# EAGLE design Placa Principal - março 2018 (EAGLE 9.0.1)
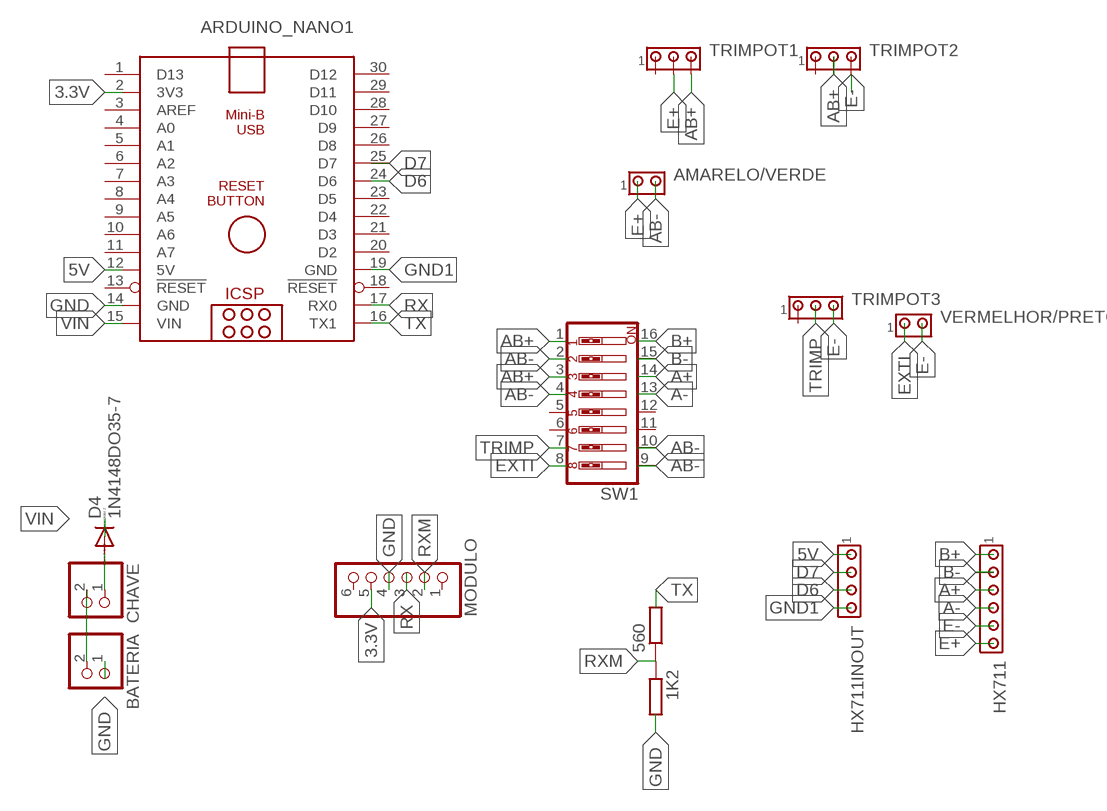
[diagram p0: schematic, sheet 1]

## Parts
1K2  R-EU_0204/5  [0204/5]
560  R-EU_0204/5  [0204/5]
AMARELO/VERDE  MTA02-100  [10X02MTA]
ARDUINO_NANO1  ARDUINO_NANO  [ARDUINO_NANO]
BATERIA  PINHD-1X2  [1X02]
CHAVE  PINHD-1X2  [1X02]
D4  1N4148DO35-7  [DO35-7]
HX711  MTA06-100  [10X06MTA]
HX711INOUT  MTA04-100  [10X04MTA]
MODULO  PINHD-1X6  [1X06]
SW1  SW_DIP-8  [EDG-08]
TRIMPOT1  MTA03-100  [10X03MTA]
TRIMPOT2  MTA03-100  [10X03MTA]
TRIMPOT3  MTA03-100  [10X03MTA]
VERMELHOR/PRETO  MTA02-100  [10X02MTA]

## Nets
3.3V: ARDUINO_NANO1.2(3V3) MODULO.5
5V: ARDUINO_NANO1.12(5V) HX711INOUT.1
A+: HX711.3 SW1.14
A-: HX711.4 SW1.13
AB+: SW1.1 SW1.3 TRIMPOT1.3 TRIMPOT2.2
AB-: AMARELO/VERDE.2 SW1.2 SW1.4 SW1.9 SW1.10
B+: HX711.1 SW1.16
B-: HX711.2 SW1.15
D6: ARDUINO_NANO1.24(D6) HX711INOUT.3
D7: ARDUINO_NANO1.25(D7) HX711INOUT.2
E+: AMARELO/VERDE.1 HX711.6 TRIMPOT1.2
E-: HX711.5 TRIMPOT2.3 TRIMPOT3.3 VERMELHOR/PRETO.2
EXTI: SW1.8 VERMELHOR/PRETO.1
GND: 1K2.2 ARDUINO_NANO1.14(GND) BATERIA.1 MODULO.4
GND1: ARDUINO_NANO1.19(GND) HX711INOUT.4
N$31: BATERIA.2 CHAVE.2
N$34: CHAVE.1 D4.A
RX: ARDUINO_NANO1.17(RX0) MODULO.3
RXM: 1K2.1 560.1 MODULO.2
TRIMP: SW1.7 TRIMPOT3.2
TX: 560.2 ARDUINO_NANO1.16(TX1)
VIN: ARDUINO_NANO1.15(VIN) D4.C
Unconnected: ARDUINO_NANO1.1(D13) ARDUINO_NANO1.3(AREF) ARDUINO_NANO1.4(A0) ARDUINO_NANO1.5(A1) ARDUINO_NANO1.6(A2) ARDUINO_NANO1.7(A3) ARDUINO_NANO1.8(A4) ARDUINO_NANO1.9(A5) ARDUINO_NANO1.10(A6) ARDUINO_NANO1.11(A7) ARDUINO_NANO1.13(!RESET) ARDUINO_NANO1.18(!RESET) ARDUINO_NANO1.20(D2) ARDUINO_NANO1.21(D3) ARDUINO_NANO1.22(D4) ARDUINO_NANO1.23(D5) ARDUINO_NANO1.26(D8) ARDUINO_NANO1.27(D9) ARDUINO_NANO1.28(D10) ARDUINO_NANO1.29(D11) ARDUINO_NANO1.30(D12) MODULO.1 MODULO.6 SW1.5 SW1.6 SW1.11 SW1.12 TRIMPOT1.1 TRIMPOT2.1 TRIMPOT3.1

## Library data of the parts
1K2 560 = resistor:R-EU_: RESISTOR, European symbol
AMARELO/VERDE VERMELHOR/PRETO = con-amp:MTA02-100: AMP connector
ARDUINO_NANO1 = ArduinoNanoV30:ARDUINO_NANO: Arduino Nano V3.0 Overview: The Arduino Nano is a small, complete, and breadboard-friendly board based on the ATmega328 (Arduino Nano 3.x) or ATmega168 (Arduino Nano 2.x). It has more or less the same functionality of the Arduino Duemilanove, but in a different package. It lacks only a DC power jack, and works with a Mini-B USB cable instead of a standard one. The Nano was designed and is being produced by Gravitech. Specifications: Microcontroller Atmel ATmega168 or ATmega328 Operating Voltage (logic level) 5 V Input Voltage (recommended) 7-12 V Input Voltage (limits) 6-20 V Digital I/O Pins 14 (of which 6 provide PWM output) Analog Input Pins 8 DC Current per I/O Pin 40 mA Flash Memory 16 KB (ATmega168) or 32 KB (ATmega328) of which 2 KB used by bootloader SRAM 1 KB (ATmega168) or 2 KB (ATmega328) EEPROM 512 bytes (ATmega168) or 1 KB (ATmega328) Clock Speed 16 MHz Dimensions 0.73" x 1.70" Length 45 mm Width 18 mm Weigth 5 g Power: The Arduino Nano can be powered via the Mini-B USB connection, 6-20V unregulated external power supply (pin 30), or 5V regulated external power supply (pin 27). The power source is automatically selected to the highest voltage source. Memory: The ATmega168 has 16 KB of flash memory for storing code (of which 2 KB is used for the bootloader); the ATmega328 has 32 KB, (also with 2 KB used for the bootloader). The ATmega168 has 1 KB of SRAM and 512 bytes of EEPROM (which can be read and written with the EEPROM library); the ATmega328 has 2 KB of SRAM and 1 KB of EEPROM. Input and Output: Each of the 14 digital pins on the Nano can be used as an input or output, using pinMode(), digitalWrite(), and digitalRead() functions. They operate at 5 volts. Each pin can provide or receive a maximum of 40 mA and has an internal pull-up resistor (disconnected by default) of 20-50 kOhms. In addition, some pins have specialized functions. Visit Arduino - ArduinoBoardNano <https://www.arduino.cc/en/Main/ArduinoBoardNano>
BATERIA CHAVE = pinhead:PINHD-1X2: PIN HEADER
D4 = diode:1N4148: DIODE high speed (Philips)
HX711 = con-amp:MTA06-100: AMP connector Connection corrected 2014-09-19
HX711INOUT = con-amp:MTA04-100: AMP connector
MODULO = pinhead:PINHD-1X6: PIN HEADER
SW1 = special:SW_DIP-8: DIP SWITCH
TRIMPOT1-TRIMPOT3 = con-amp:MTA03-100: AMP connector

## Net classes
0 default: width 0.7 mm, drill 0.3 mm, clearance 0.3 mm

## Board
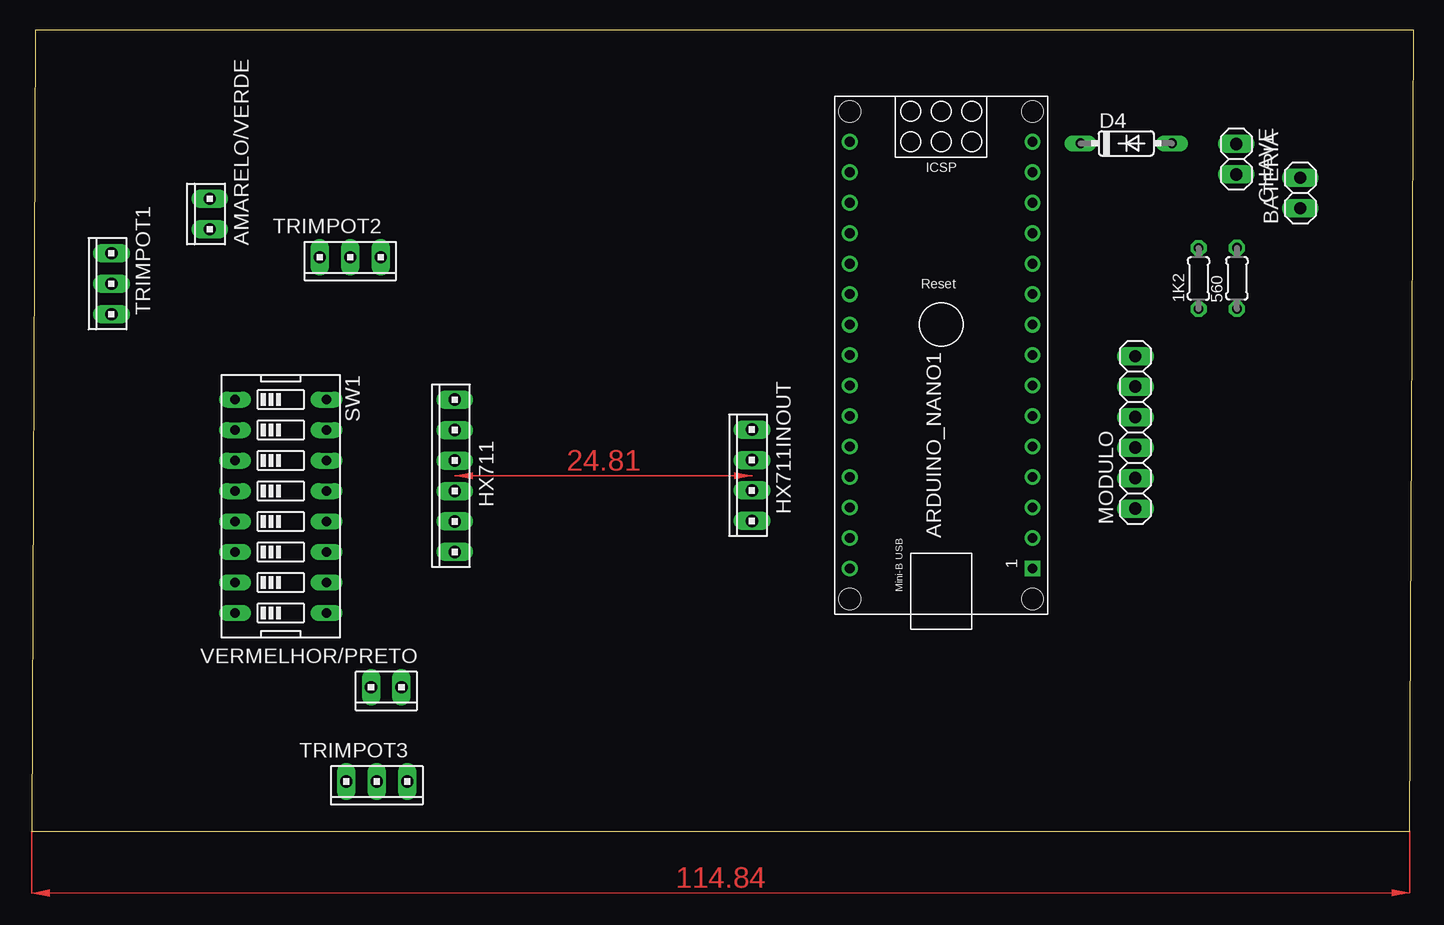
[diagram p1: board, top side]
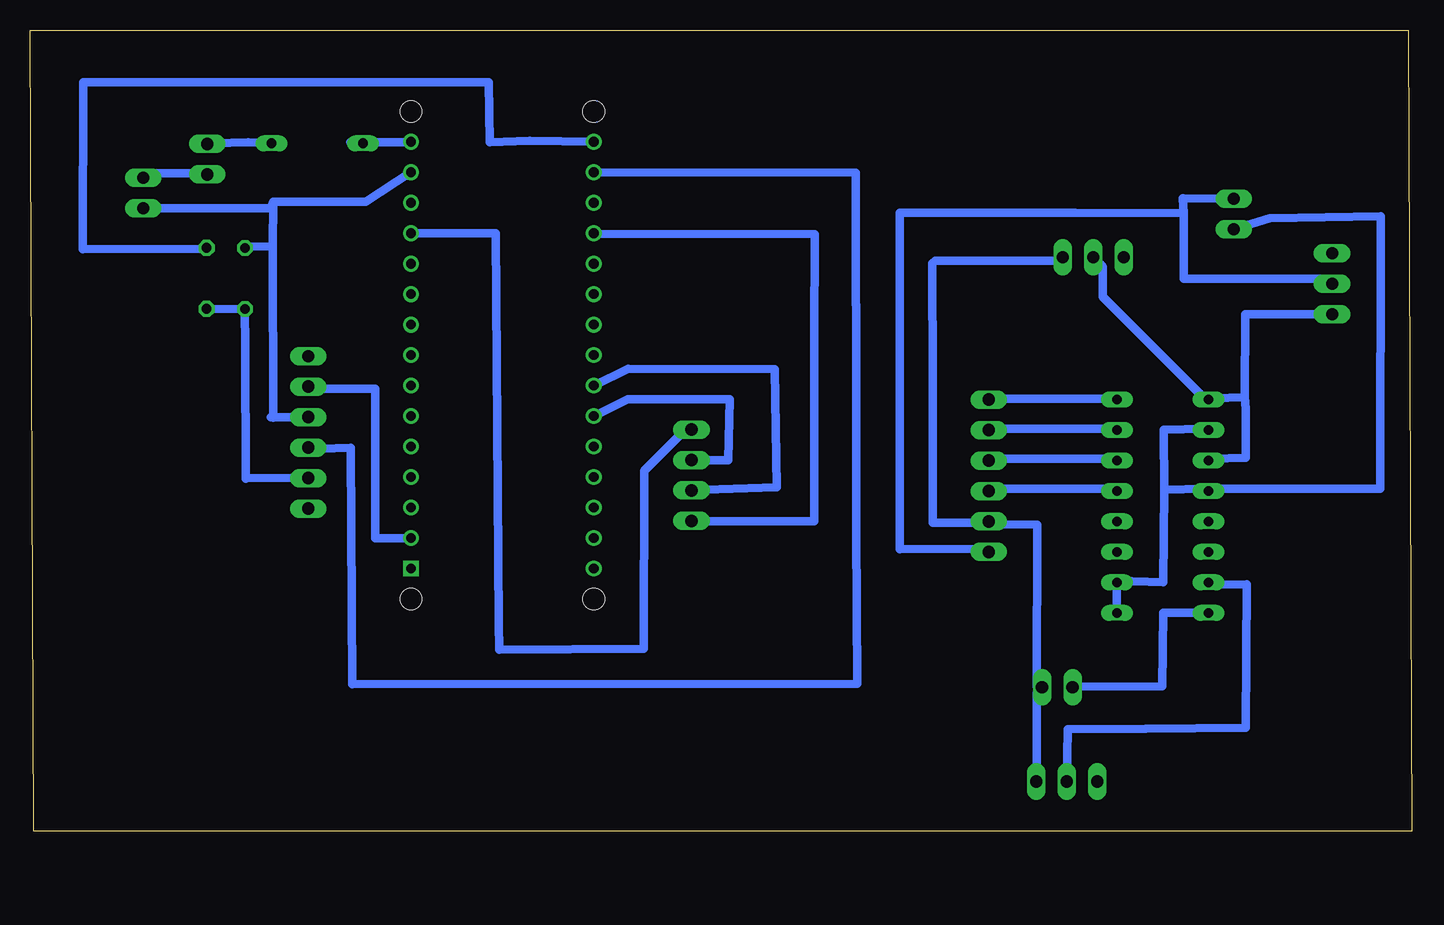
[diagram p2: board, bottom side, seen from below]

Size 115.16 x 66.78 mm. Coordinates in mm from the lower left corner, seen from the top.
Outline: 0,0 114.84,0.03 115.16,66.78 0.33,66.75 0,0
Copper layers (1*16): Top 0.035mm / dielectric 1.5mm / Bottom 0.035mm
Design rules "default": minimum track width 6mil, minimum drill 0.35mm, track to track 6mil, track to pad 6mil, pad to pad 6mil, via to via 6mil, smd to smd 6mil, copper to edge 40mil, drill to drill 6mil, minimum pad ring 10mil, minimum via ring 8mil, stop-mask expansion 4mil, vias tented up to drill 0mil, thermal gap 10mil

### Footprints (pad centres in the part's own frame; a part is rotated, then mirrored left to right if it is on the bottom)
0204/5 = drill 0.813 octagon: 1 -2.54,0; 2 2.54,0
10X02MTA = drill 1.016 long: 1 1.27,0; 2 -1.27,0
ARDUINO_NANO = drill 0.8 square: 1 -20.32,-7.62 | drill 0.8: 2 -17.78,-7.62; 3 -15.24,-7.62; 4 -12.7,-7.62; 5 -10.16,-7.62; 6 -7.62,-7.62; 7 -5.08,-7.62; 8 -2.54,-7.62; 9 0,-7.62; 10 2.54,-7.62; 11 5.08,-7.62; 12 7.62,-7.62; 13 10.16,-7.62; 14 12.7,-7.62; 15 15.24,-7.62; 16 15.24,7.62; 17 12.7,7.62; 18 10.16,7.62; 19 7.62,7.62; 20 5.08,7.62; 21 2.54,7.62; 22 0,7.62; 23 -2.54,7.62; 24 -5.08,7.62; 25 -7.62,7.62; 26 -10.16,7.62; 27 -12.7,7.62; 28 -15.24,7.62; 29 -17.78,7.62; 30 -20.32,7.62 | hole 1.778: -22.86,-7.62; -22.86,7.62; 17.78,7.62; 17.78,-7.62
1X02 = drill 1.016 long: 1 -1.27,0; 2 1.27,0
DO35-7 = drill 0.813 long: A 3.81,0; C -3.81,0
10X06MTA = drill 1.016 long: 1 6.35,0; 2 3.81,0; 3 1.27,0; 4 -1.27,0; 5 -3.81,0; 6 -6.35,0
10X04MTA = drill 1.016 long: 1 3.81,0; 2 1.27,0; 3 -1.27,0; 4 -3.81,0
1X06 = drill 1.016 long: 1 -6.35,0; 2 -3.81,0; 3 -1.27,0; 4 1.27,0; 5 3.81,0; 6 6.35,0
EDG-08 = drill 0.813 long: 1 -8.89,-3.81; 2 -6.35,-3.81; 3 -3.81,-3.81; 4 -1.27,-3.81; 5 1.27,-3.81; 6 3.81,-3.81; 7 6.35,-3.81; 8 8.89,-3.81; 9 8.89,3.81; 10 6.35,3.81; 11 3.81,3.81; 12 1.27,3.81; 13 -1.27,3.81; 14 -3.81,3.81; 15 -6.35,3.81; 16 -8.89,3.81
10X03MTA = drill 1.016 long: 1 2.54,0; 2 0,0; 3 -2.54,0

### Placement (x,y rotation side)
1K2  97.25,46.07 90 top
560  100.45,46.09 90 top
AMARELO/VERDE  14.85,51.45 90 top
ARDUINO_NANO1  75.8,42.23 90 top
BATERIA  105.73,53.21 90 top
CHAVE  100.4,56.01 270 top
D4  91.23,57.34 0 top
HX711  35.26,29.63 90 top
HX711INOUT  60.03,29.68 90 top
MODULO  91.98,33.25 90 top
SW1  20.77,27.09 270 top
TRIMPOT1  6.65,45.64 90 top
TRIMPOT2  26.56,47.84 180 top
TRIMPOT3  28.77,4.15 180 top
VERMELHOR/PRETO  29.56,12.02 180 top

### Tracks (layer width: path | path; a pad name or v marks a point on that pad's centre or on a via)
3.3V
  Bottom 0.7: ARDUINO_NANO1.2 86.39,24.43 86.39,36.87 91.11,36.87 MODULO.5
5V
  Bottom 0.7: ARDUINO_NANO1.12 82.97,49.84 76.35,49.85 76.12,17.39 76.07,15.12 64.03,15.23 63.96,30.03 60.46,33.53 HX711INOUT.1
A+
  Bottom 0.7: SW1.14 24.76,31.03 34.96,31.03 HX711.3
A-
  Bottom 0.7: SW1.13 24.76,28.53 34.96,28.53 HX711.4
AB+
  Bottom 0.7: 13.92,36.19 16.61,36.11 SW1.1 17.26,36.03 25.76,44.53 25.76,47.03 26.26,47.53 TRIMPOT2.2 | 13.92,36.19 13.85,35.24 13.85,31.13 16.76,31.03 SW1.3 | 13.92,36.19 13.87,43.1 TRIMPOT1.3
AB-
  Bottom 0.7: SW1.9 24.6,18.56 24.6,20.56 SW1.10 24.54,20.88 20.75,20.77 20.63,28.48 | 20.63,28.48 17.26,28.53 SW1.4 16.76,28.53 2.62,28.56 2.62,51.25 11.83,51.1 AMARELO/VERDE.2 | 20.63,28.48 20.69,33.49 17.26,33.53 SW1.2
B+
  Bottom 0.7: SW1.16 24.76,36.03 34.96,36.03 HX711.1
B-
  Bottom 0.7: SW1.15 24.76,33.53 34.96,33.53 HX711.2
D6
  Bottom 0.7: ARDUINO_NANO1.24 65.29,38.56 53.09,38.51 52.92,28.69 60.18,28.41 HX711INOUT.3
D7
  Bottom 0.7: ARDUINO_NANO1.25 65.35,36 56.87,36 56.98,30.94 60.18,30.91 HX711INOUT.2
E+
  Bottom 0.7: 19.03,51.53 19.09,52.74 19.06,52.76 AMARELO/VERDE.1 | 19.03,51.53 19,46.03 6.76,46.03 TRIMPOT1.2 | 19.03,51.53 28.07,51.54 42.67,51.54 42.68,23.53 35.46,23.53 HX711.6
E-
  Bottom 0.7: TRIMPOT3.3 31.26,3.53 31.26,11.53 VERMELHOR/PRETO.2 31.26,12.03 31.22,25.53 34.92,25.58 HX711.5 35.24,25.71 39.91,25.72 39.91,37.8 39.98,47.36 39.71,47.53 29.26,47.53 TRIMPOT2.3
EXTI
  Bottom 0.7: SW1.8 20.74,18.23 20.81,12.1 28.26,12.03 VERMELHOR/PRETO.1
GND
  Bottom 0.7: ARDUINO_NANO1.14 87.17,52.46 94.89,52.46 | 94.93,48.75 94.89,52.46 | 94.93,48.75 97.25,48.72 1K2.2 | 94.93,48.75 94.91,34.48 95.12,34.51 MODULO.4 | 94.89,52.46 95.04,51.93 BATERIA.1
GND1
  Bottom 0.7: ARDUINO_NANO1.19 68.32,49.8 49.77,49.77 49.8,41.06 49.82,40.99 49.81,25.85 59.96,25.85 HX711INOUT.4
N$31
  Bottom 0.7: CHAVE.2 100.41,54.85 105.61,54.85 BATERIA.2
N$34
  Bottom 0.7: D4.A 96.97,57.42 99.91,57.35 CHAVE.1
RX
  Bottom 0.7: ARDUINO_NANO1.17 46.37,54.89 46.35,43.9 46.3,43.87 46.3,25.03 46.25,12.29 88.32,12.24 88.44,31.95 91.01,31.87 MODULO.3
RXM
  Bottom 0.7: 560.1 100.43,43.26 100.56,43.53 1K2.1 97.23,40.33 97.2,29.38 97.05,29.48 MODULO.2
TRIMP
  Bottom 0.7: SW1.7 16.76,20.53 13.75,20.6 13.84,8.62 22.19,8.54 28.68,8.5 28.76,4.09 TRIMPOT3.2
TX
  Bottom 0.7: ARDUINO_NANO1.16 73.53,57.53 76.86,57.41 76.92,62.43 82.47,62.42 110.73,62.41 110.76,48.52 100.43,48.54 560.2
VIN
  Bottom 0.7: ARDUINO_NANO1.15 83.47,57.42 88.47,57.42 D4.C
(copper drawn outside any net)
  shapes: Top area x2